# Altium schematic sheet L4N-24VDimmer.SchDoc: Overview
size A3; DocumentNumber: 1; Revision: 1.0; SheetNumber: 1; SheetTotal: 4
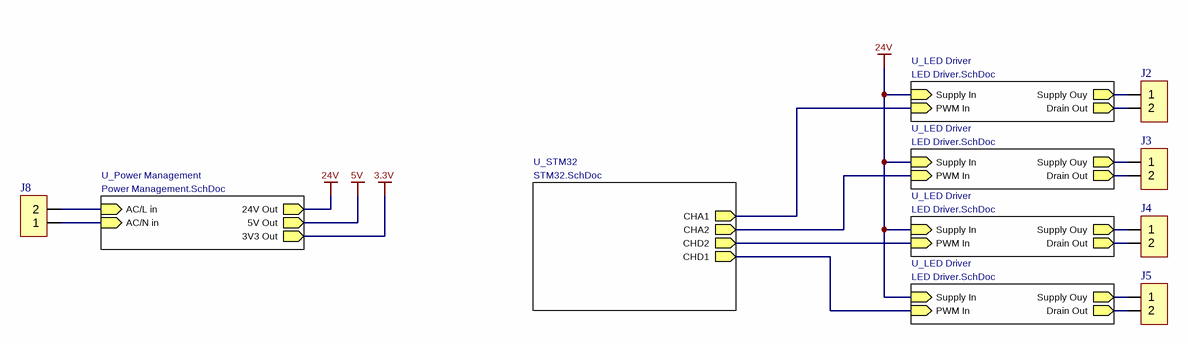
[diagram p0: L4N-24VDimmer.SchDoc]

## Parts
J2  (no value)  [WAGO_2060-452/998-404]
J3  (no value)  [WAGO_2060-452/998-404]
J4  (no value)  [WAGO_2060-452/998-404]
J5  (no value)  [WAGO_2060-452/998-404]
J8  (no value)  [WAGO_2060-452/998-404]

## Sub-sheets
U_LED Driver = LED Driver.SchDoc: PWM In (in), Drain Out (out), Supply Ouy (out), Supply In (in)
U_LED Driver = LED Driver.SchDoc: PWM In (in), Drain Out (out), Supply Ouy (out), Supply In (in)
U_LED Driver = LED Driver.SchDoc: PWM In (in), Drain Out (out), Supply Ouy (out), Supply In (in)
U_LED Driver = LED Driver.SchDoc: PWM In (in), Drain Out (out), Supply Ouy (out), Supply In (in)
U_Power Management = Power Management.SchDoc: 5V Out (out), 3V3 Out (out), 24V Out (out), AC/L in (in), AC/N in (in)
U_STM32 = STM32.SchDoc: CHA2 (out), CHD1 (out), CHD2 (out), CHA1 (out)

## Nets
3.3V: sheet U_Power Management/3V3 Out
5V: sheet U_Power Management/5V Out
24V: sheet U_Power Management/24V Out, sheet U_LED Driver/Supply In, sheet U_LED Driver/Supply In, sheet U_LED Driver/Supply In, sheet U_LED Driver/Supply In
NetJ2_1: J2.1 ; sheet U_LED Driver/Supply Ouy
NetJ2_2: J2.2 ; sheet U_LED Driver/Drain Out
NetJ3_1: J3.1 ; sheet U_LED Driver/Supply Ouy
NetJ3_2: J3.2 ; sheet U_LED Driver/Drain Out
NetJ4_1: J4.1 ; sheet U_LED Driver/Supply Ouy
NetJ4_2: J4.2 ; sheet U_LED Driver/Drain Out
NetJ5_1: J5.1 ; sheet U_LED Driver/Supply Ouy
NetJ5_2: J5.2 ; sheet U_LED Driver/Drain Out
NetJ8_1: J8.1 ; sheet U_Power Management/AC/N in
NetJ8_2: J8.2 ; sheet U_Power Management/AC/L in
(unnamed): sheet U_STM32/CHA2, sheet U_LED Driver/PWM In
(unnamed): sheet U_STM32/CHD1, sheet U_LED Driver/PWM In
(unnamed): sheet U_STM32/CHD2, sheet U_LED Driver/PWM In
(unnamed): sheet U_STM32/CHA1, sheet U_LED Driver/PWM In

## Notes on the sheet
- Redako
- Keilestraat 5a, 3029BP, Rotterdam, M: david@redako.nl, T: +31 6 16001008
- Project
- Title
- Customer
- Size:
- Date:
- File:
- A4
- Revision:
- Time:
- Drawn by:
- GIT Revision:
- Sheet:
- of

## Library data of the parts
J2-J5 J8 = JST_Connector_2Pin: MPN: 2060-452/998-404